# EAGLE design mcu_battery (EAGLE 9.5.2)
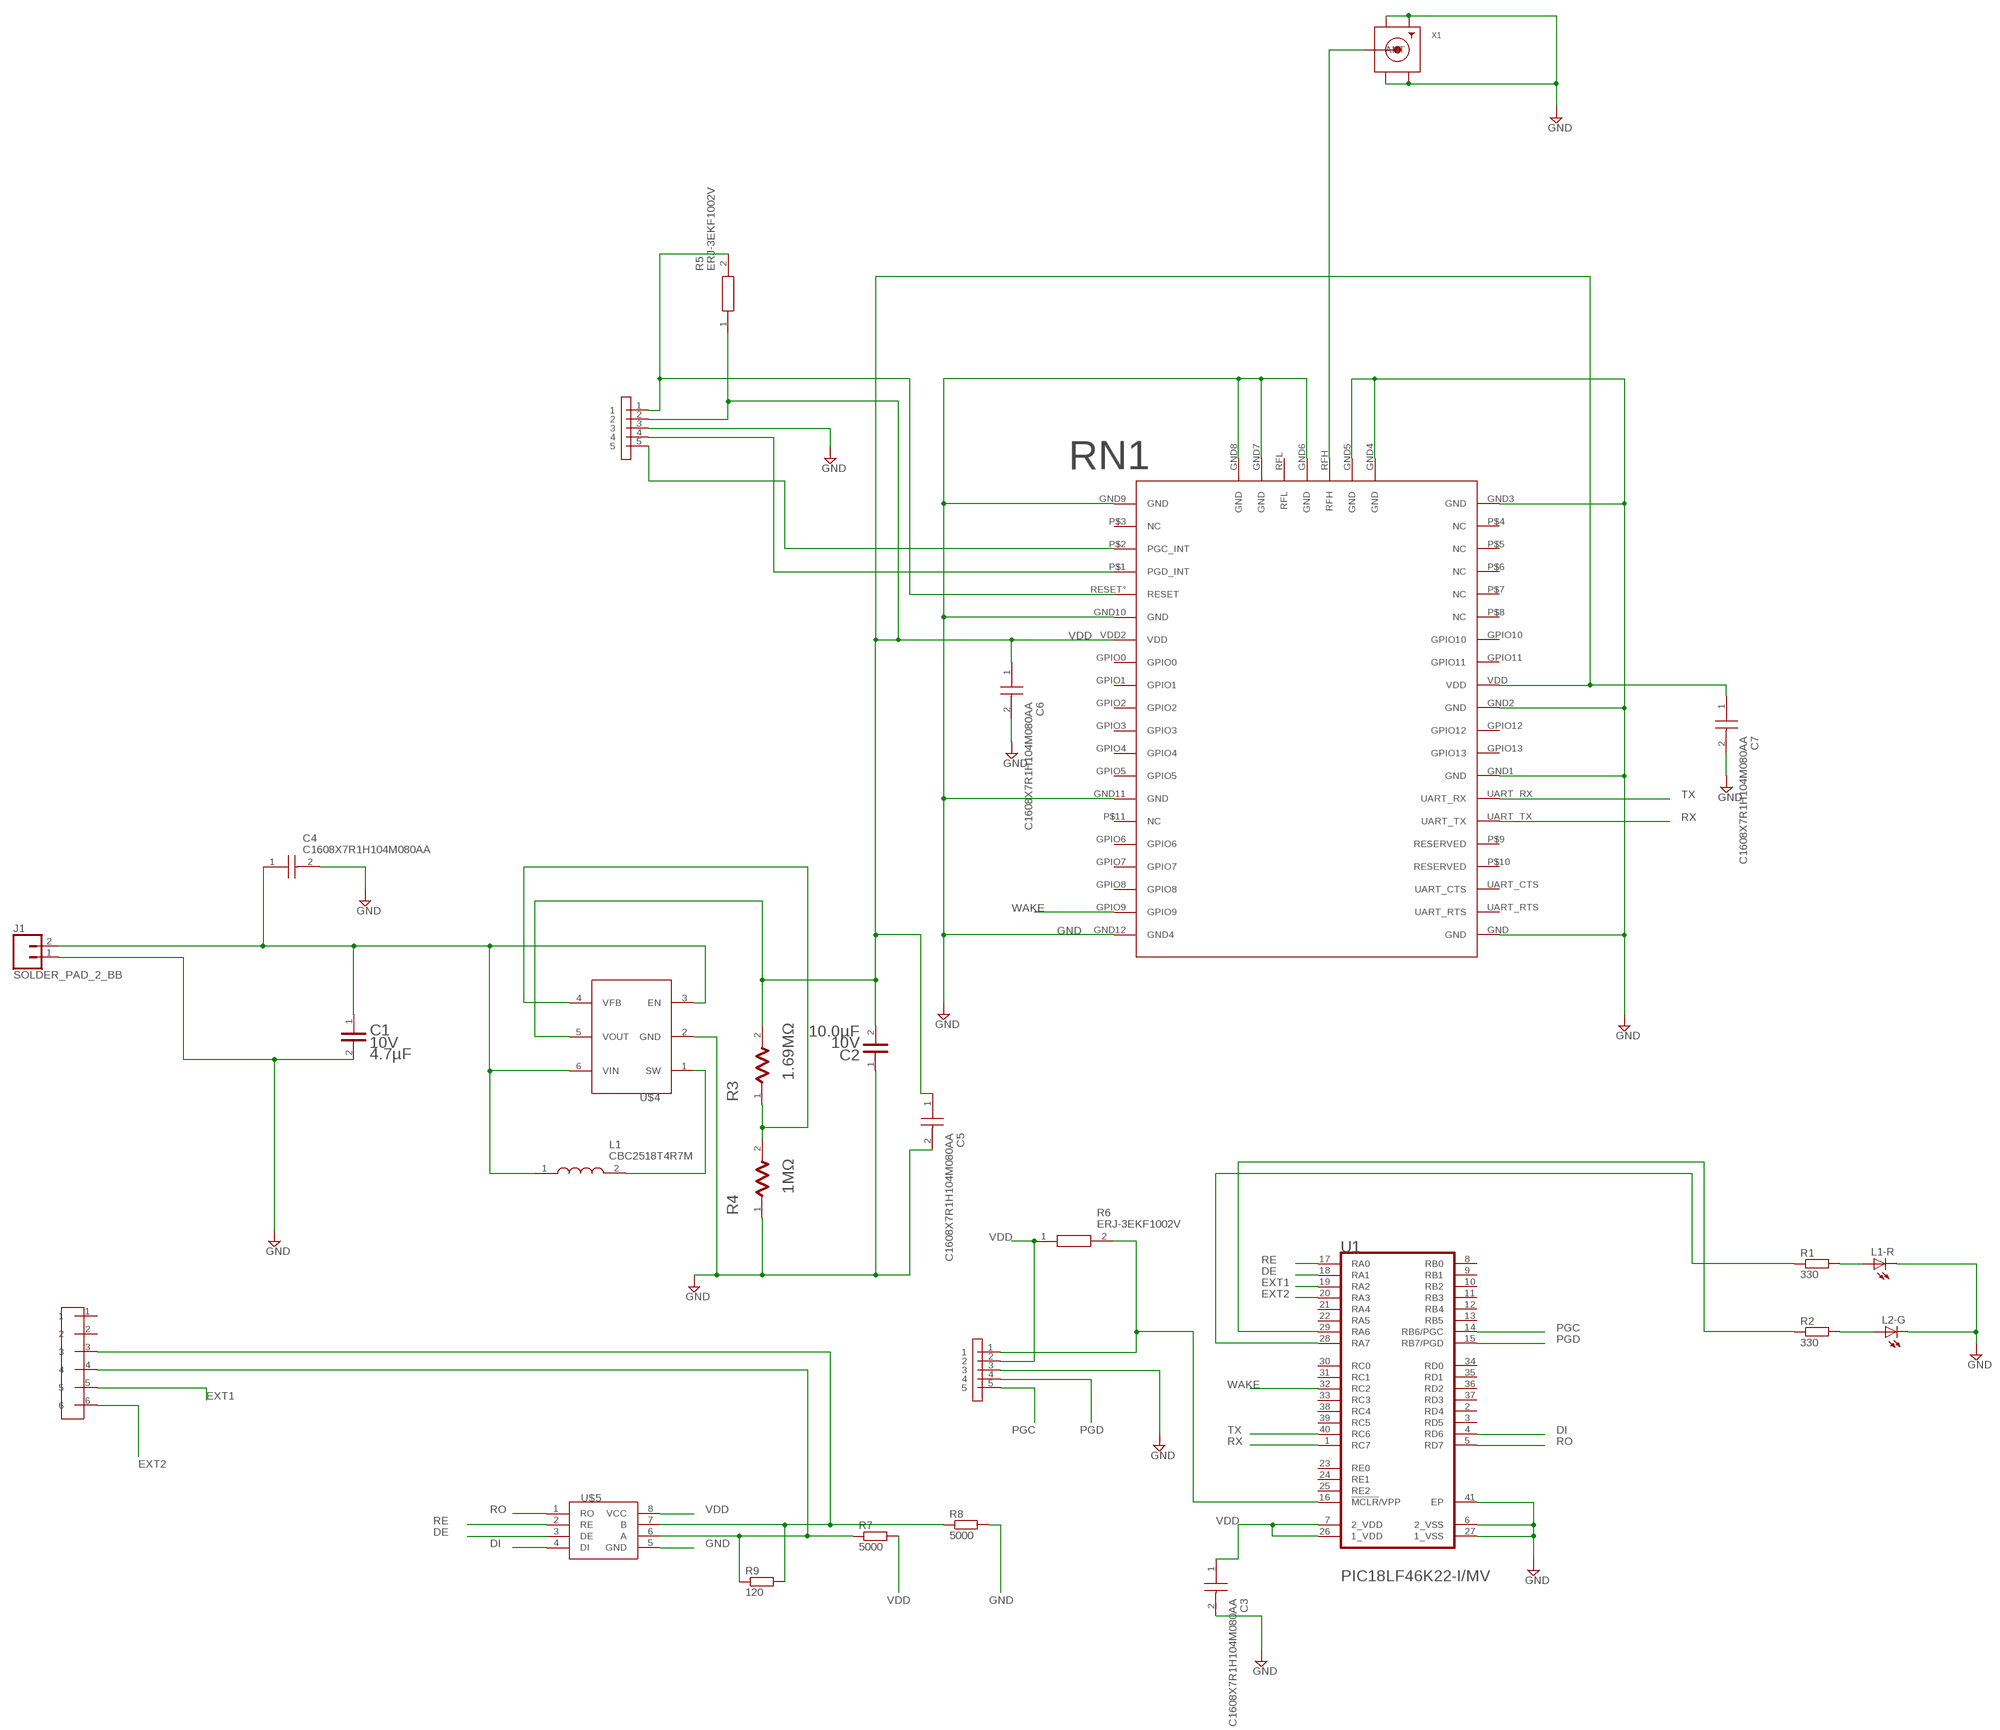
[diagram p0: schematic, sheet 1]

## Parts
C1  KEMET_C0603C475K8PACTUKEMET_C0603C475K8PACTU_0_0  [KEMET_C0603C475K8PACTU_0]
C2  TDK_C1608X5R1A106M080ACTDK_C1608X5R1A106M080AC_0_0  [TDK_C1608X5R1A106M080AC_0]
C3  C1608X7R1H104M080AA  [CAPC1608X80N]
C4  C1608X7R1H104M080AA  [CAPC1608X80N]
C5  C1608X7R1H104M080AA  [CAPC1608X80N]
C6  C1608X7R1H104M080AA  [CAPC1608X80N]
C7  C1608X7R1H104M080AA  [CAPC1608X80N]
J1  SOLDER_PAD_2_BB  [SOLDER_PAD_2]
L1  CBC2518T4R7M  [INDC2518X200N]
L1-R  LEDCHIP-LED0603  [CHIP-LED0603]
L2-G  LEDCHIP-LED0603  [CHIP-LED0603]
R1  330  R-EU_R0603  [R0603]
R2  330  R-EU_R0603  [R0603]
R3  VISHAY_CRCW06031M69FKEAVISHAY_CRCW06031M69FKEA_0_1  [VISHAY_CRCW06031M69FKEA_1]
R4  STACKPOLE_RMCF0603FT1M00STACKPOLE_RMCF0603FT1M00_0_1  [STACKPOLE_RMCF0603FT1M00_1]
R5  ERJ-3EKF1002V  [RESC1608X55N]
R6  ERJ-3EKF1002V  [RESC1608X55N]
R7  5000  R-EU_R0805  [R0805]
R8  5000  R-EU_R0805  [R0805]
R9  120  R-EU_R0805  [R0805]
RN1  NEW_RN2483  [NEW_RN2483]
U1  MICROCHIP_PIC18LF46K22-I-MVMICROCHIP_PIC18LF46K22-I-MV_0_1  [MICROCHIP_PIC18LF46K22-I-MV_1]
U5  CONNECTOR6_V2  [CONNECTOR6_V2]
U$2  ICSP52  [ICSP]
U$3  ICSP_V2  [ICSP_V2]
U$4  MCP16252  [MCP16252]
U$5  AMD3485E  [AMD3485E]
X1  SMACONNECTOR_EDGE  [SMA_EDGELAUNCH]

## Nets
DE: U1.18(RA1) U$5.3(DE)
DI: U1.4(RD6) U$5.4(DI)
EXT1: U1.19(RA2) U5.5
EXT2: U1.20(RA3) U5.6
GND: C1.2 C2.1 C3.2 C4.2 C5.2 C6.2 C7.2 J1.1 L1-R.C L2-G.C R4.1 R8.2 RN1.GND RN1.GND1(GND) RN1.GND2(GND) RN1.GND3(GND) RN1.GND4(GND) RN1.GND5(GND) RN1.GND6(GND) RN1.GND7(GND) RN1.GND8(GND) RN1.GND9(GND) RN1.GND10(GND) RN1.GND11(GND) RN1.GND12(GND4) U1.6(2_VSS) U1.27(1_VSS) U1.41(EP) U$2.3 U$3.3 U$4.2(GND) U$5.5(GND) X1.GND@1(GND4) X1.GND@2(GND3) X1.GND@3(GND2) X1.GND@4(GND1)
MCLR: R6.2 U1.16(!MCLR!/VPP) U$2.1
N$1: R2.1 U1.29(RA6)
N$2: L2-G.A R2.2
N$3: R1.1 U1.28(RA7)
N$4: C1.1 C4.1 J1.2 L1.1 U$4.3(EN) U$4.6(VIN)
N$5: L1-R.A R1.2
N$6: L1.2 U$4.1(SW)
N$7: R5.2 RN1.RESET°(RESET) U$3.1
N$8: RN1.RFH X1.P(ANT)
N$9: R3.1 R4.2 U$4.4(VFB)
N$10: RN1.P$2(PGC_INT) U$3.5
N$12: RN1.P$1(PGD_INT) U$3.4
N$13: R8.1 R9.2 U5.3 U$5.7(B)
N$14: R7.1 R9.1 U5.4 U$5.6(A)
PGC: U1.14(RB6/PGC) U$2.5
PGD: U1.15(RB7/PGD) U$2.4
RE: U1.17(RA0) U$5.2(RE)
RO: U1.5(RD7) U$5.1(RO)
RX: RN1.UART_TX U1.1(RC7)
TX: RN1.UART_RX U1.40(RC6)
VDD: C2.2 C3.1 C5.1 C6.1 C7.1 R3.2 R5.1 R6.1 R7.2 RN1.VDD RN1.VDD2(VDD) U1.7(2_VDD) U1.26(1_VDD) U$2.2 U$3.2 U$4.5(VOUT) U$5.8(VCC)
WAKE: RN1.GPIO9 U1.32(RC2)
Unconnected: RN1.GPIO0 RN1.GPIO1 RN1.GPIO2 RN1.GPIO3 RN1.GPIO4 RN1.GPIO5 RN1.GPIO6 RN1.GPIO7 RN1.GPIO8 RN1.GPIO10 RN1.GPIO11 RN1.GPIO12 RN1.GPIO13 RN1.P$3(NC) RN1.P$4(NC) RN1.P$5(NC) RN1.P$6(NC) RN1.P$7(NC) RN1.P$8(NC) RN1.P$9(RESERVED) RN1.P$10(RESERVED) RN1.P$11(NC) RN1.RFL RN1.UART_CTS RN1.UART_RTS U1.2(RD4) U1.3(RD5) U1.8(RB0) U1.9(RB1) U1.10(RB2) U1.11(RB3) U1.12(RB4) U1.13(RB5) U1.21(RA4) U1.22(RA5) U1.23(RE0) U1.24(RE1) U1.25(RE2) U1.30(RC0) U1.31(RC1) U1.33(RC3) U1.34(RD0) U1.35(RD1) U1.36(RD2) U1.37(RD3) U1.38(RC4) U1.39(RC5) U5.1 U5.2

## Library data of the parts
C1 = Kemet - C0603C475K8PACTU:KEMET_C0603C475K8PACTU: CAP CER 4.7UF 10V X5R 0603; CAPACITANCE: 4.7µF; CENTROID_NOT_SPECIFIED: No; DATASHEET: https://search.kemet.com/component-edge/download/datasheet/C0603C475K8PACTU.pdf; DIGIKEY_DESCRIPTION: CAP CER 4.7UF 10V X5R 0603; DIGIKEY_PART_NUMBER: 399-5503-1-ND; LEAD_FREE: yes; MF: Kemet; MFG_PACKAGE_IDENT: C0603; MOUSER_DESCRIPTION: Multilayer Ceramic Capacitors MLCC - SMD/SMT 10volts 4.7uF 10% X5R; MOUSER_PART_NUMBER: 80-C0603C475K8P; MPN: C0603C475K8PACTU; PACKAGE: 0603; PREFIX: C; ROHS: yes; TEMPERATURE_RANGE_HIGH: +85°C; TEMPERATURE_RANGE_LOW: -55°C; VOLTAGE: 10V
C2 = TDK - C1608X5R1A106M080AC:TDK_C1608X5R1A106M080AC: 10 uF Ceramic Capacitor; CAPACITANCE: 10.0µF; CAPACITANCE_TOLERANCE: ±20%; CENTROID_NOT_SPECIFIED: No; DATASHEET: https://product.tdk.com/info/en/catalog/datasheets/mlcc_commercial_general_en.pdf; DIELECTRIC_CHARACTERISTIC: X5R; DIELECTRIC_MATERIAL: Ceramic Multilayer; DIGIKEY_DESCRIPTION: CAP CER 10UF 10V X5R 0603; DIGIKEY_PART_NUMBER: 445-6853-1-ND; IMPORTED_FROM: octopart; IPC_LAND_PATTERN_NAME: CAPC16080X80; LEAD_FREE: yes; MF: TDK; MOUSER_PART_NUMBER: 810-C1608X5R1A106M; MPN: C1608X5R1A106M080AC; NUM_PINS: 2; OCTOPART_PART_NUMBER: f5f73d6e4e4d2a30; PACKAGE: 0603; PREFIX: C; ROHS: yes; SIZE_LENGTH: 1.6 mm; SIZE_THICKNESS: 800 um; SIZE_WIDTH: 800 um; TEMPERATURE_RANGE_HIGH: +85°C; TEMPERATURE_RANGE_LOW: -55°C; VOLTAGE: 10V; VOLTAGE_RATING_DC: 10 V
C3-C7 = C1608X7R1H104M080AA:C1608X7R1H104M080AA: TDK 0603 C 100nF Ceramic Multilayer Capacitor, 50 V dc, +125C, X7R Dielectric, +/-20% Source: Datasheet <https://product.tdk.com/info/en/catalog/datasheets/mlcc_commercial_midvoltage_en.pdf>; ARROW_PART_NUMBER: C1608X7R1H104M080AA; ARROW_PRICE-STOCK: https://www.arrow.com/en/products/c1608x7r1h104m080aa/tdk; DESCRIPTION: TDK 0603 C 100nF Ceramic Multilayer Capacitor, 50 V dc, +125C, X7R Dielectric, +/-20%; HEIGHT: 0.8mm; MANUFACTURER_NAME: TDK; MANUFACTURER_PART_NUMBER: C1608X7R1H104M080AA; MOUSER_PART_NUMBER: 810-C1608X7R1H104M; MOUSER_PRICE-STOCK: https://www.mouser.co.uk/ProductDetail/TDK/C1608X7R1H104M080AA?qs=dfay7wIA1uEL2BE%2FFUaTdg%3D%3D
J1 = SparkFun-Connectors:SOLDER_PAD_2_BB: Solder Pad for LuMini Rings
L1 = CBC2518T4R7M:CBC2518T4R7M: Fixed Inductors INDCTR HI CUR WND 1007 4.7uH 20% Source: Datasheet <http://ds.yuden.co.jp/TYCOMPAS/ut/detail.do?productNo=CBC2518T4R7M&dataUnit=M.pdf>; ARROW_PART_NUMBER: CBC2518T4R7M; DESCRIPTION: Fixed Inductors INDCTR HI CUR WND 1007 4.7uH 20%; HEIGHT: 2mm; MANUFACTURER_NAME: TAIYO YUDEN; MANUFACTURER_PART_NUMBER: CBC2518T4R7M; MOUSER_PART_NUMBER: 963-CBC2518T4R7M; MOUSER_PRICE-STOCK: https://www.mouser.com/Search/Refine.aspx?Keyword=963-CBC2518T4R7M
L1-R L2-G = adafruit:LED: LED OSRAM: - CHIPLED LG R971, LG N971, LY N971, LG Q971, LY Q971, LO R971, LY R971 LH N974, LH R974 LS Q976, LO Q976, LY Q976 LO Q996 - Hyper CHIPLED LW Q18S LB Q993, LB Q99A, LB R99A - SideLED LS A670, LO A670, LY A670, LG A670, LP A670 LB A673, LV A673, LT A673, LW A673 LH A674 LY A675 LS A676, LA A676, LO A676, LY A676, LW A676 LS A679, LY A679, LG A679 - Hyper Micro SIDELED® LS Y876, LA Y876, LO Y876, LY Y876 LT Y87S - SmartLED LW L88C, LW L88S LB L89C, LB L89S, LG L890 LS L89K, LO L89K, LY L89K LS L896, LA L896, LO L896, LY L896 - TOPLED LS T670, LO T670, LY T670, LG T670, LP T670 LSG T670, LSP T670, LSY T670, LOP T670, LYG T670 LG T671, LOG T671, LSG T671 LB T673, LV T673, LT T673, LW T673 LH T674 LS T676, LA T676, LO T676, LY T676, LB T676, LH T676, LSB T676, LW T676 LB T67C, LV T67C, LT T67C, LS T67K, LO T67K, LY T67K, LW E67C LS E67B, LA E67B, LO E67B, LY E67B, LB E67C, LV E67C, LT E67C LW T67C LS T679, LY T679, LG T679 LS T770, LO T770, LY T770, LG T770, LP T770 LB T773, LV T773, LT T773, LW T773 LH T774 LS E675, LA E675, LY E675, LS T675 LS T776, LA T776, LO T776, LY T776, LB T776 LHGB T686 LT T68C, LB T68C - Hyper Mini TOPLED® LB M676 - Mini TOPLED Santana® LG M470 LS M47K, LO M47K, LY M47K Source: http://www.osram.convergy.de/
R1 R2 R7-R9 = rcl:R-EU_: RESISTOR, European symbol; SPICEPREFIX: R
R3 = Vishay - CRCW06031M69FKEA:VISHAY_CRCW06031M69FKEA: RES Thick Film SMD 1.69MΩ 1% 1/10W 0603 100ppm/K; APPROVED_ALTERNATE_PART_NUMBER: 541-1.00HHCT-ND; CENTROID_NOT_SPECIFIED: No; COMPOSITION: Thick Film; DATASHEET: https://www.vishay.com/docs/20035/dcrcwe3.pdf; DEVICE_CLASS_L1: Passive Components; DEVICE_CLASS_L2: Resistors; DEVICE_CLASS_L3: Chip SMD Resistors; DIGIKEY_DESCRIPTION: RES SMD 1.69M OHM 1% 1/10W 0603; DIGIKEY_PART_NUMBER: 541-1.69MHTR-ND; FOOTPRINT_PARAMETERS_0: {"fp_type":"chip_res","params":{"L":{"nom":1550000,"long name":"Length","min":1500000,"max":1650000,"short name":"L","type":"measurement"},"W":{"nom":850000,"long name":"Width","min":750000,"max":950000,"short name":"W","type":"measurement"},"t":{"nom":450000,"long name":"Height","min":400000,"max":500000,"short name":"t","type":"measurement"},"b":{"nom":300000,"long name":"Terminal width","min":100000,"max":500000,"short name":"b","type":"measurement"},"P":{"default":"false","long name":"Polarized","type":"multichoice","short name":"P"},"offset x":{"nom":0,"long name":"X Center offset","min":null,"max":null,"short name":"offset x","type":"measurement"},"offset y":{"nom":0,"long name":"Y Center offset","min":null,"max":null,"short name":"offset y","type":"measurement"},"LS":{"long name":"Land shape","type":"fixed","short name":"LS","value":"Rectangle"},"solder toe":{"nom":550000,"long name":"Solder fillet (toe)","min":null,"max":null,"short name":"solder toe","type":"fixedmeasurement"},"solder heel":{"nom":-50000,"long name":"Solder fillet (heel)","min":null,"max":null,"short name":"solder heel","type":"fixedmeasurement"},"solder side":{"nom":50000,"long name":"Solder fillet (side)","min":null,"max":null,"short name":"solder side","type":"fixedmeasurement"},"courtyard":{"nom":500000,"long name":"Courtyard","min":null,"max":null,"short name":"courtyard","type":"fixedmeasurement"},"SF":{"default":"A (>= 1608 metric)","long name":"Packing level","type":"multichoiceparent","short name":"SF","help":"http://support.upverter.com/customer/portal/articles/978783-what-is-a-footprint-packing-level","children":["solder toe","solder heel","solder side","courtyard"]}}}; FOOTPRINT_PARAMETERS_1: {"fp_type":"chip_res","params":{"L":{"nom":1550000,"long name":"Length","min":1500000,"max":1650000,"short name":"L","type":"measurement"},"W":{"nom":850000,"long name":"Width","min":750000,"max":950000,"short name":"W","type":"measurement"},"t":{"nom":450000,"long name":"Height","min":400000,"max":500000,"short name":"t","type":"measurement"},"b":{"nom":300000,"long name":"Terminal width","min":100000,"max":500000,"short name":"b","type":"measurement"},"P":{"default":"false","long name":"Polarized","type":"multichoice","short name":"P"},"offset x":{"nom":0,"long name":"X Center offset","min":null,"max":null,"short name":"offset x","type":"measurement"},"offset y":{"nom":0,"long name":"Y Center offset","min":null,"max":null,"short name":"offset y","type":"measurement"},"LS":{"long name":"Land shape","type":"fixed","short name":"LS","value":"Rectangle"},"solder toe":{"nom":350000,"long name":"Solder fillet (toe)","min":null,"max":null,"short name":"solder toe","type":"fixedmeasurement"},"solder heel":{"nom":-50000,"long name":"Solder fillet (heel)","min":null,"max":null,"short name":"solder heel","type":"fixedmeasurement"},"solder side":{"nom":0,"long name":"Solder fillet (side)","min":null,"max":null,"short name":"solder side","type":"fixedmeasurement"},"courtyard":{"nom":250000,"long name":"Courtyard","min":null,"max":null,"short name":"courtyard","type":"fixedmeasurement"},"SF":{"default":"B (>= 1608 metric)","long name":"Packing level","type":"multichoiceparent","short name":"SF","help":"http://support.upverter.com/customer/portal/articles/978783-what-is-a-footprint-packing-level","children":["solder toe","solder heel","solder side","courtyard"]}}}; FOOTPRINT_PARAMETERS_2: {"fp_type":"chip_res","params":{"L":{"nom":1550000,"long name":"Length","min":1500000,"max":1650000,"short name":"L","type":"measurement"},"W":{"nom":850000,"long name":"Width","min":750000,"max":950000,"short name":"W","type":"measurement"},"t":{"nom":450000,"long name":"Height","min":400000,"max":500000,"short name":"t","type":"measurement"},"b":{"nom":300000,"long name":"Terminal width","min":100000,"max":500000,"short name":"b","type":"measurement"},"P":{"default":"false","long name":"Polarized","type":"multichoice","short name":"P"},"offset x":{"nom":0,"long name":"X Center offset","min":null,"max":null,"short name":"offset x","type":"measurement"},"offset y":{"nom":0,"long name":"Y Center offset","min":null,"max":null,"short name":"offset y","type":"measurement"},"LS":{"long name":"Land shape","type":"fixed","short name":"LS","value":"Rectangle"},"solder toe":{"nom":150000,"long name":"Solder fillet (toe)","min":null,"max":null,"short name":"solder toe","type":"fixedmeasurement"},"solder heel":{"nom":-50000,"long name":"Solder fillet (heel)","min":null,"max":null,"short name":"solder heel","type":"fixedmeasurement"},"solder side":{"nom":-50000,"long name":"Solder fillet (side)","min":null,"max":null,"short name":"solder side","type":"fixedmeasurement"},"courtyard":{"nom":100000,"long name":"Courtyard","min":null,"max":null,"short name":"courtyard","type":"fixedmeasurement"},"SF":{"default":"C (>= 1608 metric)","long name":"Packing level","type":"multichoiceparent","short name":"SF","help":"http://support.upverter.com/customer/portal/articles/978783-what-is-a-footprint-packing-level","children":["solder toe","solder heel","solder side","courtyard"]}}}; FOOTPRINT_VARIANT_NAME_0: IPC_A; FOOTPRINT_VARIANT_NAME_1: IPC_B; FOOTPRINT_VARIANT_NAME_2: IPC_C; FOOTPRINT_VARIANT_NAME_3: Recommended_Land_Pattern; HEIGHT: 0.5mm; IPC_LAND_PATTERN_NAME: RESC15585X45; LEAD_FREE: yes; MF: Vishay; MFG_PACKAGE_IDENT: CRCW0603; MFG_PACKAGE_IDENT_DATE: 0; MFG_PACKAGE_IDENT_REV: 0; MOUSER_DESCRIPTION: Thick Film Resistors - SMD 1/10watt 1.69Mohms 1%; MOUSER_PART_NUMBER: 71-CRCW06031M69FKEA; MPN: CRCW06031M69FKEA; PACKAGE: 0603 (1608 Metric); POWER: 100mW; POWER_RATING: 0.1W; PREFIX: R; RESISTANCE: 1.69MΩ; ROHS: yes; SERIES: CRCW; STANDOFF_HEIGHT: 0mm; TEMPERATURE_COEFFICIENT: 100ppm/K; TEMPERATURE_RANGE_HIGH: +155°C; TEMPERATURE_RANGE_LOW: -55°C; TOLERANCE: 1%; VERIFICATION_VERSION: 0.0.0.1; VOLTAGE: 75V; VOLTAGE_RATING: 75V
R4 = Stackpole - RMCF0603FT1M00:STACKPOLE_RMCF0603FT1M00: RES Thick Film SMD 1MΩ 1% 1/10W 0603 100ppm/°C; APPROVED_ALTERNATE_PART_NUMBER: 541-1.00HHCT-ND; CENTROID_NOT_SPECIFIED: No; COMPOSITION: Thick Film; DATASHEET: https://www.seielect.com/Catalog/SEI-RMCF_RMCP.pdf; DEVICE_CLASS_L1: Passive Components; DEVICE_CLASS_L2: Resistors; DEVICE_CLASS_L3: Chip SMD Resistors; DIGIKEY_DESCRIPTION: RES TF 1/10W 1M OHM 1% 0603; DIGIKEY_PART_NUMBER: RMCF0603FT1M00-ND; FOOTPRINT_PARAMETERS_0: {"fp_type":"chip_res","params":{"L":{"nom":1550000,"long name":"Length","min":1500000,"max":1650000,"short name":"L","type":"measurement"},"W":{"nom":850000,"long name":"Width","min":750000,"max":950000,"short name":"W","type":"measurement"},"t":{"nom":450000,"long name":"Height","min":400000,"max":500000,"short name":"t","type":"measurement"},"b":{"nom":300000,"long name":"Terminal width","min":100000,"max":500000,"short name":"b","type":"measurement"},"P":{"default":"false","long name":"Polarized","type":"multichoice","short name":"P"},"offset x":{"nom":0,"long name":"X Center offset","min":null,"max":null,"short name":"offset x","type":"measurement"},"offset y":{"nom":0,"long name":"Y Center offset","min":null,"max":null,"short name":"offset y","type":"measurement"},"LS":{"long name":"Land shape","type":"fixed","short name":"LS","value":"Rectangle"},"solder toe":{"nom":550000,"long name":"Solder fillet (toe)","min":null,"max":null,"short name":"solder toe","type":"fixedmeasurement"},"solder heel":{"nom":-50000,"long name":"Solder fillet (heel)","min":null,"max":null,"short name":"solder heel","type":"fixedmeasurement"},"solder side":{"nom":50000,"long name":"Solder fillet (side)","min":null,"max":null,"short name":"solder side","type":"fixedmeasurement"},"courtyard":{"nom":500000,"long name":"Courtyard","min":null,"max":null,"short name":"courtyard","type":"fixedmeasurement"},"SF":{"default":"A (>= 1608 metric)","long name":"Packing level","type":"multichoiceparent","short name":"SF","help":"http://support.upverter.com/customer/portal/articles/978783-what-is-a-footprint-packing-level","children":["solder toe","solder heel","solder side","courtyard"]}}}; FOOTPRINT_PARAMETERS_1: {"fp_type":"chip_res","params":{"L":{"nom":1550000,"long name":"Length","min":1500000,"max":1650000,"short name":"L","type":"measurement"},"W":{"nom":850000,"long name":"Width","min":750000,"max":950000,"short name":"W","type":"measurement"},"t":{"nom":450000,"long name":"Height","min":400000,"max":500000,"short name":"t","type":"measurement"},"b":{"nom":300000,"long name":"Terminal width","min":100000,"max":500000,"short name":"b","type":"measurement"},"P":{"default":"false","long name":"Polarized","type":"multichoice","short name":"P"},"offset x":{"nom":0,"long name":"X Center offset","min":null,"max":null,"short name":"offset x","type":"measurement"},"offset y":{"nom":0,"long name":"Y Center offset","min":null,"max":null,"short name":"offset y","type":"measurement"},"LS":{"long name":"Land shape","type":"fixed","short name":"LS","value":"Rectangle"},"solder toe":{"nom":350000,"long name":"Solder fillet (toe)","min":null,"max":null,"short name":"solder toe","type":"fixedmeasurement"},"solder heel":{"nom":-50000,"long name":"Solder fillet (heel)","min":null,"max":null,"short name":"solder heel","type":"fixedmeasurement"},"solder side":{"nom":0,"long name":"Solder fillet (side)","min":null,"max":null,"short name":"solder side","type":"fixedmeasurement"},"courtyard":{"nom":250000,"long name":"Courtyard","min":null,"max":null,"short name":"courtyard","type":"fixedmeasurement"},"SF":{"default":"B (>= 1608 metric)","long name":"Packing level","type":"multichoiceparent","short name":"SF","help":"http://support.upverter.com/customer/portal/articles/978783-what-is-a-footprint-packing-level","children":["solder toe","solder heel","solder side","courtyard"]}}}; FOOTPRINT_PARAMETERS_2: {"fp_type":"chip_res","params":{"L":{"nom":1550000,"long name":"Length","min":1500000,"max":1650000,"short name":"L","type":"measurement"},"W":{"nom":850000,"long name":"Width","min":750000,"max":950000,"short name":"W","type":"measurement"},"t":{"nom":450000,"long name":"Height","min":400000,"max":500000,"short name":"t","type":"measurement"},"b":{"nom":300000,"long name":"Terminal width","min":100000,"max":500000,"short name":"b","type":"measurement"},"P":{"default":"false","long name":"Polarized","type":"multichoice","short name":"P"},"offset x":{"nom":0,"long name":"X Center offset","min":null,"max":null,"short name":"offset x","type":"measurement"},"offset y":{"nom":0,"long name":"Y Center offset","min":null,"max":null,"short name":"offset y","type":"measurement"},"LS":{"long name":"Land shape","type":"fixed","short name":"LS","value":"Rectangle"},"solder toe":{"nom":150000,"long name":"Solder fillet (toe)","min":null,"max":null,"short name":"solder toe","type":"fixedmeasurement"},"solder heel":{"nom":-50000,"long name":"Solder fillet (heel)","min":null,"max":null,"short name":"solder heel","type":"fixedmeasurement"},"solder side":{"nom":-50000,"long name":"Solder fillet (side)","min":null,"max":null,"short name":"solder side","type":"fixedmeasurement"},"courtyard":{"nom":100000,"long name":"Courtyard","min":null,"max":null,"short name":"courtyard","type":"fixedmeasurement"},"SF":{"default":"C (>= 1608 metric)","long name":"Packing level","type":"multichoiceparent","short name":"SF","help":"http://support.upverter.com/customer/portal/articles/978783-what-is-a-footprint-packing-level","children":["solder toe","solder heel","solder side","courtyard"]}}}; FOOTPRINT_VARIANT_NAME_0: IPC_A; FOOTPRINT_VARIANT_NAME_1: IPC_B; FOOTPRINT_VARIANT_NAME_2: IPC_C; FOOTPRINT_VARIANT_NAME_3: Recommended_Land_Pattern; HEIGHT: 0.5mm; IPC_LAND_PATTERN_NAME: RESC15585X45; LEAD_FREE: yes; MF: Stackpole; MFG_PACKAGE_IDENT: RMCF0603; MFG_PACKAGE_IDENT_DATE: 0; MFG_PACKAGE_IDENT_REV: 0; MPN: RMCF0603FT1M00; PACKAGE: 0603 (1608 Metric); POWER: 100mW; POWER_RATING: 0.1W; PREFIX: R; RESISTANCE: 1MΩ; ROHS: yes; SERIES: RMCF; STANDOFF_HEIGHT: 0mm; TEMPERATURE_COEFFICIENT: 100ppm/°C; TEMPERATURE_RANGE_HIGH: +155°C; TEMPERATURE_RANGE_LOW: -55°C; TOLERANCE: 1%; VERIFICATION_VERSION: 0.0.0.1; VOLTAGE: 75V; VOLTAGE_RATING: 75V
R5 R6 = ERJ-3EKF1002V:ERJ-3EKF1002V: Thick Film Resistors - SMD 0603 10Kohms 1% AEC-Q200 Source: Datasheet <http://industrial.panasonic.com/cdbs/www-data/pdf/RDA0000/AOA0000C86.pdf>; ARROW_PART_NUMBER: ERJ-3EKF1002V; ARROW_PRICE-STOCK: https://www.arrow.com/en/products/erj-3ekf1002v/panasonic; DESCRIPTION: Thick Film Resistors - SMD 0603 10Kohms 1% AEC-Q200; HEIGHT: 0.55mm; MANUFACTURER_NAME: Panasonic; MANUFACTURER_PART_NUMBER: ERJ-3EKF1002V; MOUSER_PART_NUMBER: 667-ERJ-3EKF1002V; MOUSER_PRICE-STOCK: https://www.mouser.co.uk/ProductDetail/Panasonic/ERJ-3EKF1002V?qs=H7k1u0Mp9JSrGPQ5%2F5COuw%3D%3D
RN1 = tobias:NEW_RN2483
U1 = MV:MICROCHIP_PIC18LF46K22-I-MV: MCHP-PIC18F4XK22-UQFN-40; CIIVA_IDS: 1156885; COMPONENT_LINK_2_DESCRIPTION: Package Specification; COMPONENT_LINK_2_URL: http://www.microchip.com/stellent/groups/techpub_sg/documents/packagingspec/en012702.pdf; COMPONENT_LINK_3_DESCRIPTION: URL Link1; COMPONENT_LINK_3_URL: Product URL:http://www.microchip.com/datasheet/PIC18F46K22; DATASHEET: http://ww1.microchip.com/downloads/en/DeviceDoc/41412F.pdf; DATASHEET_VERSION: Rev. F; DIGITAL_COMMUNICATION: 2-A/E/USART, 2-MSSP(SPI/I2C); EEPROM_DATA_MEMORY_BYTES: 1024; FOOTPRINT_VARIANT_NAME_0: Level C; FOOTPRINT_VARIANT_NAME_1: Level B; FOOTPRINT_VARIANT_NAME_2: Level A; IMPORTED: yes; IMPORTED_FROM: vault; IMPORT_TS: 1521862508; INTERNAL_OSCILLATOR: 16 MHz, 31 kHz; IO_PINS: 35; MAX_CPU_SPEED_MHZ: 16; MEMORY_TYPE: Flash; MF: Microchip; MOUNTING_TECHNOLOGY: Surface Mount; MPN: PIC18LF46K22-I/MV; OF_AD_CHANNELS: 28; OPERATION_VOLTAGE_RANGE: 1.8V - 3.6V; PACKAGE: UQFN-MV40; PACKAGE_DESCRIPTION: 40-Lead Plastic Ultra Thin Quad Flat, No Lead Package, Body 5 x 5 mm, Pitch 0.4 mm; PACKAGE_VERSION: C04-156A, 04/2013; PACKING: TUBE; PIN_0_0_13_INSIDE_EDGE: clock; PREFIX: U; PROGRAM_MEMORY_KBYTES: 64; PROGRAM_MEMORY_KWORDS: 32; RAM: 3896; RELEASE_DATE: 1370054166; TIMERS: 3 - 8-bit, 4 - 16-bit; VAULT_GUID: 4AD4499F-4258-456F-8BC1-D82EC74C6FCE; VAULT_REVISION: 1F45D5E2-C531-4F36-B47A-F05F4A728A22
U5 = conn4:CONNECTOR6_V2
U$2 = conn4:ICSP52
U$3 = conn4:ICSP_V2
U$4 = my_library:MCP16252
U$5 = AMD3485E:AMD3485E
X1 = adafruit:SMACONNECTOR: SMA Connector 90° DIP SMA Connector, 50 Ohm (4UConnector: 07259)

## Net classes
0 default: width 0.203 mm, drill 0.508 mm, clearance 0.203 mm

## Board
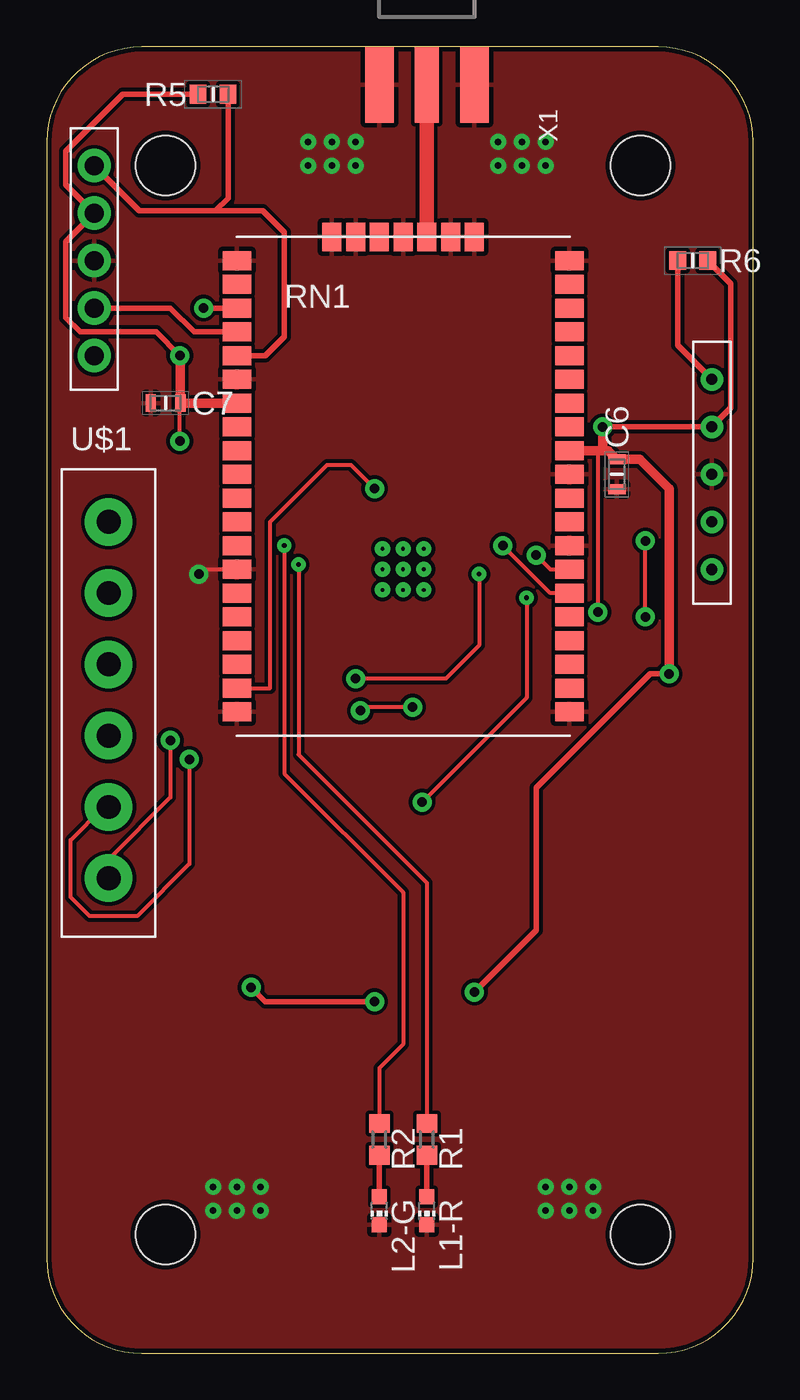
[diagram p1: board, top side]
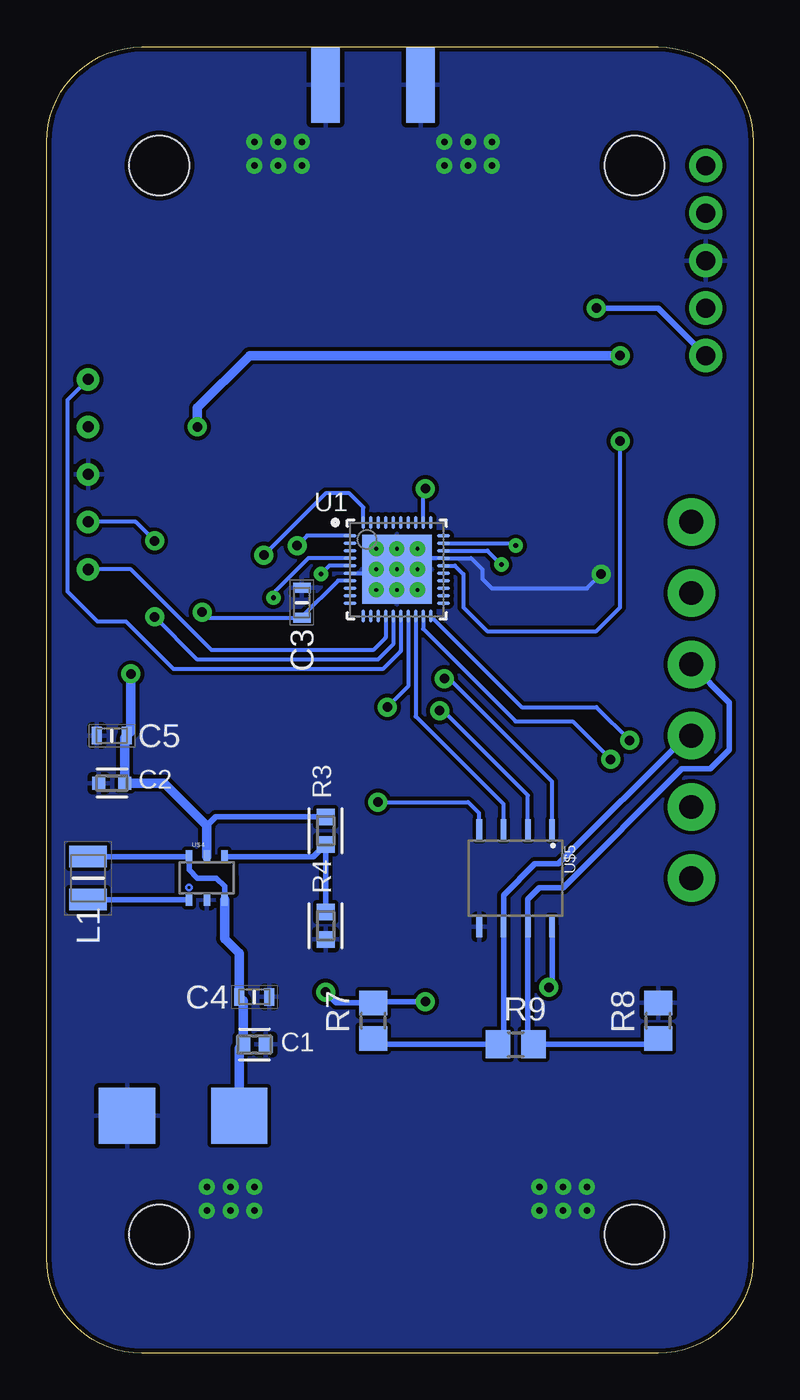
[diagram p2: board, bottom side, seen from below]

Size 37.77 x 69.84 mm. Coordinates in mm from the lower left corner, seen from the top.
Outline: 0,64.76 0,5.08 arc90 5.08,0 32.69,0 arc90 37.77,5.08 37.77,64.76 arc90 32.69,69.84 5.08,69.84 arc90 0,64.76
Copper layers (1*16): Top 0.035mm / dielectric 1.5mm / Bottom 0.035mm
Design rules "SparkFun": minimum track width 8mil, minimum drill 20mil, track to track 8mil, track to pad 8mil, pad to pad 8mil, via to via 8mil, smd to smd 8mil, copper to edge 10mil, drill to drill 8mil, minimum pad ring 12mil, minimum via ring 10mil, stop-mask expansion 4mil, vias tented up to drill 25mil, thermal gap 10mil
Holes 3.2 mm at 6.35,6.35 31.75,6.35 31.75,63.5 6.35,63.5

### Footprints (pad centres in the part's own frame; a part is rotated, then mirrored left to right if it is on the bottom)
KEMET_C0603C475K8PACTU_0 = smd 0.75 x 0.9: 1 -0.6,0; 2 0.6,0
TDK_C1608X5R1A106M080AC_0 = smd 0.7 x 0.7: 1 -0.7,0; 2 0.7,0
CAPC1608X80N = smd 0.54 x 0.94: 1 -0.8,0; 2 0.8,0
SOLDER_PAD_2 = smd 3 x 3: 1 -3,0; 2 3,0
INDC2518X200N = smd 1.15 x 2: 1 -1.15,0; 2 1.15,0
CHIP-LED0603 = smd 0.8 x 0.8: A 0,-0.75; C 0,0.75
R0603 = smd 1 x 1.1: 1 -0.85,0; 2 0.85,0
VISHAY_CRCW06031M69FKEA_1 = smd 0.891 x 0.962: 1 -0.737,0; 2 0.737,0
STACKPOLE_RMCF0603FT1M00_1 = smd 0.891 x 0.962: 1 -0.737,0; 2 0.737,0
RESC1608X55N = smd 0.9 x 1: 1 -0.8,0; 2 0.8,0
R0805 = smd 1.3 x 1.5: 1 -0.95,0; 2 0.95,0
NEW_RN2483 = smd 1.524 x 1.016: GND 17.78,1.27; GND1 17.78,10.16; GND2 17.78,13.97; GND3 17.78,25.4; GND9 0,25.4; GND10 0,19.05; GND11 0,8.89; GND12 0,1.27; GPIO0 0,16.51; GPIO1 0,15.24; GPIO2 0,13.97; GPIO3 0,12.7; GPIO4 0,11.43; GPIO5 0,10.16; GPIO6 0,6.35; GPIO7 0,5.08; GPIO8 0,3.81; GPIO9 0,2.54; GPIO10 17.78,17.78; GPIO11 17.78,16.51; GPIO12 17.78,12.7; GPIO13 17.78,11.43; P$1 0,21.59; P$2 0,22.86; P$3 0,24.13; P$4 17.78,24.13; P$5 17.78,22.86; P$6 17.78,21.59; P$7 17.78,20.32; P$8 17.78,19.05; P$9 17.78,6.35; P$10 17.78,5.08; P$11 0,7.62; RESET° 0,20.32; UART_CTS 17.78,3.81; UART_RTS 17.78,2.54; UART_RX 17.78,8.89; UART_TX 17.78,7.62; VDD 17.78,15.24; VDD2 0,17.78 | smd 1.016 x 1.524: GND4 12.7,26.67; GND5 11.43,26.67; GND6 8.89,26.67; GND7 6.35,26.67; GND8 5.08,26.67; RFH 10.16,26.67; RFL 7.62,26.67
MICROCHIP_PIC18LF46K22-I-MV_1 = smd 0.7 x 0.2: 1 -2.5,1.8; 2 -2.5,1.4; 3 -2.5,1; 4 -2.5,0.6; 5 -2.5,0.2; 6 -2.5,-0.2; 7 -2.5,-0.6; 8 -2.5,-1; 9 -2.5,-1.4; 10 -2.5,-1.8; 21 2.5,-1.8; 22 2.5,-1.4; 23 2.5,-1; 24 2.5,-0.6; 25 2.5,-0.2; 26 2.5,0.2; 27 2.5,0.6; 28 2.5,1; 29 2.5,1.4; 30 2.5,1.8 | smd 0.2 x 0.7: 11 -1.8,-2.5; 12 -1.4,-2.5; 13 -1,-2.5; 14 -0.6,-2.5; 15 -0.2,-2.5; 16 0.2,-2.5; 17 0.6,-2.5; 18 1,-2.5; 19 1.4,-2.5; 20 1.8,-2.5; 31 1.8,2.5; 32 1.4,2.5; 33 1,2.5; 34 0.6,2.5; 35 0.2,2.5; 36 -0.2,2.5; 37 -0.6,2.5; 38 -1,2.5; 39 -1.4,2.5; 40 -1.8,2.5 | smd 3.7 x 3.7: 41 0,0 | drill 0.2 pad 0.5: PAD_1 1.1,-1.1; PAD_2 0,-1.1; PAD_3 -1.1,-1.1; PAD_4 1.1,0; PAD_5 0,0; PAD_6 -1.1,0; PAD_7 1.1,1.1; PAD_8 0,1.1; PAD_9 -1.1,1.1
CONNECTOR6_V2 = drill 1.27 pad 2.54: 1 -0.5,-3.81; 2 -0.5,-7.62; 3 -0.5,-11.43; 4 -0.5,-15.24; 5 -0.5,-19.05; 6 -0.5,-22.86
ICSP = drill 0.6: 1 -0.002,-0.002; 2 -0.002,-2.542; 3 -0.002,-5.082; 4 -0.002,-7.622; 5 -0.002,-10.162
ICSP_V2 = drill 1.016 pad 1.778: 1 -0.002,-0.002; 2 -0.002,-2.542; 3 -0.002,-5.082; 4 -0.002,-7.622; 5 -0.002,-10.162
MCP16252 = smd 0.35 x 0.675: 1 -0.95,-1.15; 2 0,-1.15; 3 0.95,-1.15; 4 0.95,1.15; 5 0,1.15; 6 -0.95,1.15
AMD3485E = smd 1.1 x 0.3: 1 -2.6,1.95; 2 -2.6,0.65; 3 -2.6,-0.65; 4 -2.6,-1.95; 5 2.6,-1.95; 6 2.6,-0.65; 7 2.6,0.65; 8 2.6,1.95
SMA_EDGELAUNCH = smd 4.064 x 1.524: GND@1 2.032,-2.54; GND@2 2.032,2.54 | smd 4.064 x 1.524 bottom: GND@3 2.032,2.54; GND@4 2.032,-2.54 | smd 4.064 x 1.27: P 2.032,0

### Placement (x,y rotation side)
C1  26.67,16.51 0 bottom
C2  34.29,30.48 0 bottom
C3  24.13,40.13 90 bottom
C4  26.67,19.05 0 bottom
C5  34.29,33.02 180 bottom
C6  30.48,46.99 270 top
C7  6.35,50.8 180 top
J1  30.48,12.7 0 bottom
L1  35.56,25.4 270 bottom
L1-R  20.32,7.62 180 top
L2-G  17.78,7.62 180 top
R1  20.32,11.43 270 top
R2  17.78,11.43 270 top
R3  22.86,27.94 90 bottom
R4  22.86,22.86 90 bottom
R5  8.89,67.31 0 top
R6  34.54,58.42 180 top
R7  20.32,17.78 90 bottom
R8  5.08,17.78 90 bottom
R9  12.7,16.51 0 bottom
RN1  10.16,33.02 0 top
U1  19.05,41.91 0 bottom
U5  3.81,48.26 0 top
U$2  35.56,52.07 0 top
U$3  2.54,63.5 0 top
U$4  29.21,25.4 0 bottom
U$5  12.7,25.4 270 bottom
X1  20.32,69.85 270 top

### Tracks (layer width: path | path; a pad name or v marks a point on that pad's centre or on a via)
DE
  Bottom 0.203: U$5.3 13.35,29.35 18.05,34.05 U1.18
DI  (via drill 0.25, 0.51)
  Top 0.203: v25.65,40.39 25.65,35.05 v20.07,29.46
  Bottom 0.203: U$5.4 14.65,28.87 15.24,29.46 v20.07,29.46 | U1.4 23.78,42.51 25.65,40.64 v25.65,40.39
EXT1  (via drill 0.51)
  Top 0.203: v7.62,31.75 7.62,26.16 4.83,23.37 2.29,23.37 1.27,24.38 1.27,27.43 3.05,29.21 U5.5
  Bottom 0.203: U1.19 17.65,38.73 12.7,33.78 9.65,33.78 v7.62,31.75
EXT2  (via drill 0.51)
  Top 0.203: v6.6,32.77 6.6,29.72 3.31,26.42 U5.6
  Bottom 0.203: U1.20 12.38,34.54 8.38,34.54 v6.6,32.77
GND  (via drill 0.35, 0.51)
  Top 0.203: v8.13,41.66 8.38,41.91 RN1.GND11
  Bottom 0.203: U1.6 20.27,41.71 20.07,41.91 U1.41 | 18.03,41.91 17.43,42.51 U1.27 15.08,42.51 14.48,41.91 14.48,41.4 13.97,40.89 8.89,40.89 v8.13,41.66
  Bottom 0.305: 18.03,41.91 U1.41
  other vias: 16.51,64.77 16.51,63.5 15.24,64.77 15.24,63.5 13.97,64.77 13.97,63.5 24.13,64.77 24.13,63.5 25.4,63.5 25.4,64.77 26.67,64.77 26.67,63.5 29.21,7.62 29.21,8.89 27.94,8.89 27.94,7.62 26.67,7.62 26.67,8.89 8.89,7.62 8.89,8.89 10.16,8.89 11.43,8.89 11.43,7.62 10.16,7.62
  pour Top: -1.27,71.12 39.37,71.12 39.37,-1.27 -1.27,-1.27
  pour Bottom: -2.54,72.39 40.64,72.39 40.64,-2.54 -2.54,-2.54
MCLR
  Top 0.305: U$2.1 33.74,53.88 R6.2
  Bottom 0.203: U1.16 18.85,37.54 19.81,36.58 30.99,36.58 33.53,39.12 35.05,39.12 36.65,40.72 36.65,50.97 U$2.1
N$1  (via drill 0.25)
  Top 0.203: R2.1 17.78,15.24 19.05,16.51 19.05,24.64 12.7,30.99 v12.7,43.18
  Bottom 0.203: U1.29 12.83,43.31 v12.7,43.18
N$2
  Top 0.305: R2.2 L2-G.A
N$3  (via drill 0.25)
  Top 0.203: R1.1 20.32,25.15 13.46,32 v13.46,42.16
  Bottom 0.203: U1.28 14.21,42.91 v13.46,42.16
N$4
  Bottom 0.305: L1.1 U$4.6 30.16,25.84 29.72,25.4 28.7,25.4 28.26,24.96 U$4.3
  Bottom 0.508: J1.2 27.48,16.3 C1.1 27.27,18.85 C4.1 27.47,21.37 28.26,22.16 U$4.3
N$5
  Top 0.305: R1.2 L1-R.A
N$6
  Bottom 0.305: U$4.1 L1.2
N$7
  Top 0.305: R5.2 9.69,61.76 9.02,61.09 | RN1.RESET° 11.68,53.34 12.7,54.36 12.7,59.94 11.55,61.09 9.02,61.09 | U$3.1 4.95,61.09 9.02,61.09
N$8
  Top 0.762: RN1.RFH X1.P
N$9
  Bottom 0.305: U$4.4 23.51,26.55 R3.1 R4.2
N$10  (via drill 0.51)
  Top 0.305: v8.38,55.88 RN1.P$2
  Bottom 0.305: U$3.5 5.08,55.88 v8.38,55.88
N$12
  Top 0.305: RN1.P$1 7.87,54.61 6.6,55.88 U$3.4
N$13
  Bottom 0.305: R8.1 5.4,16.51 R9.2 12.05,16.81 U$5.7 12.05,24.27 11.43,24.89 10.16,24.89 3.81,31.24 2.29,31.24 1.27,32.26 1.27,34.79 U5.3
N$14
  Bottom 0.305: R7.1 20,16.51 R9.1 13.35,16.81 U$5.6 13.35,24.5 11.68,26.16 10.41,26.16 3.56,33.02 U5.4
PGC
  Bottom 0.203: U1.14 19.65,38.26 20.32,37.59 28.96,37.59 33.27,41.91 U$2.5
PGD  (via drill 0.51)
  Top 0.203: v32,39.37 v32,43.43
  Bottom 0.203: U1.15 19.25,37.9 20.07,37.08 29.72,37.08 v32,39.37 | v32,43.43 33.02,44.45 U$2.4
RE  (via drill 0.51)
  Top 0.203: v19.56,34.54 16.96,34.54 v16.76,34.35
  Bottom 0.203: U$5.2 12.05,29.83 16.57,34.35 v16.76,34.35 | U1.17 18.45,35.65 v19.56,34.54
RO  (via drill 0.25, 0.51)
  Top 0.203: v23.11,41.66 23.11,37.85 21.34,36.07 v16.51,36.07
  Bottom 0.203: U$5.1 10.75,30.56 16.26,36.07 v16.51,36.07 | U1.5 22.66,42.11 v23.11,41.66
RX  (via drill 0.51)
  Top 0.203: RN1.UART_TX 26.92,40.64 v24.38,43.18
  Bottom 0.203: U1.1 23.85,43.71 v24.38,43.18
TX  (via drill 0.51)
  Top 0.203: v26.16,42.67 26.92,41.91 RN1.UART_RX
  Bottom 0.203: U1.40 20.85,45.19 20.83,45.21 21.59,45.97 22.86,45.97 v26.16,42.67
VDD  (via drill 0.51)
  Top 0.203: 29.72,48.26 29.46,48.01 v29.46,39.62 | v7.11,48.77 7.11,50.76 C7.1
  Top 0.305: v29.72,49.53 U$2.2 36.58,50.55 36.58,57.19 R6.1 | R5.1 4.06,67.31 1.02,64.26 1.02,62.48 U$3.2 1.02,59.44 1.02,55.37 1.78,54.61 5.84,54.61 v7.11,53.34 | v10.92,19.56 11.68,18.8 v17.53,18.8 | v22.86,19.3 26.16,22.61 26.16,30.23 32.26,36.32 v33.27,36.32
  Top 0.508: 29.72,48.26 30.01,48.26 C6.1 31.71,47.79 33.27,46.23 v33.27,36.32 | 29.72,48.26 RN1.VDD | RN1.VDD2 C7.1 7.15,53.3 v7.11,53.34 | v29.72,49.53 29.72,48.26
  Bottom 0.203: v29.46,39.62 29.17,39.33 C3.1 24.13,39.37 22.19,41.31 U1.7 | U1.26 15.95,42.11 15.49,41.66 15.49,39.88 14.22,38.61 8.38,38.61 7.11,39.88 v7.11,48.77
  Bottom 0.305: 29.21,28.19 28.73,28.68 R3.2 | U$5.8 10.75,19.73 v10.92,19.56 | v17.53,18.8 20.25,18.8 R7.2 22.29,18.73 v22.86,19.3
  Bottom 0.508: v33.27,36.32 33.27,33.24 C5.1 33.59,32.92 C2.2 31.5,30.48 29.21,28.19 U$4.5 | v7.11,53.34 26.92,53.34 29.72,50.55 v29.72,49.53
WAKE  (via drill 0.51)
  Top 0.203: RN1.GPIO9 11.94,35.56 11.94,44.45 14.99,47.5 16.26,47.5 v17.53,46.23
  Bottom 0.203: U1.32 17.65,46.1 v17.53,46.23